# Altium schematic sheet 3_BackBone.SchDoc
size A3; DocumentNumber: 4; SheetNumber: 4; SheetTotal: 6
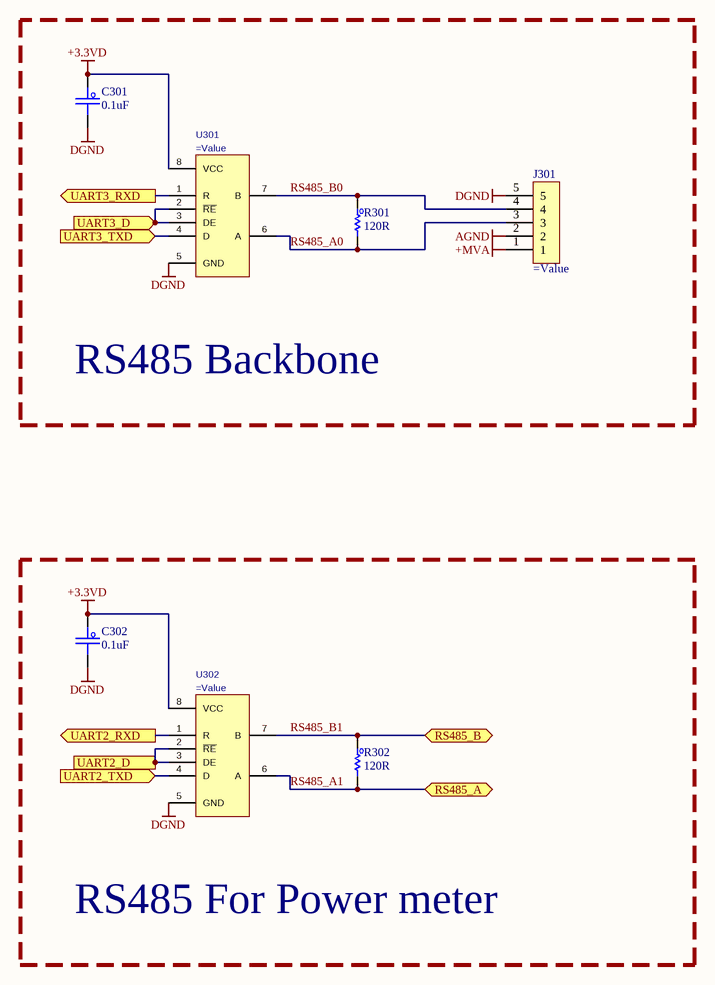
[diagram p0: 3_BackBone.SchDoc]

## Parts
C301  0.1uF  [C_0603]  (no BOM)
C302  0.1uF  [C_0603]
J301  (no value)  [CON_9155005541006]  (no BOM)
R301  120R  [R_0603]  (no BOM)
R302  120R  [R_0603]
U301  (no value)  [D0008A_L]  (no BOM)
U302  (no value)  [D0008A_L]

## Blocks framed on the sheet
RS485 Backbone: C301 J301 R301 U301
RS485 For Power meter: C302 R302 U302

## Ports
RS485_A (bidir), RS485_B (bidir), UART2_D (in), UART2_RXD (out), UART2_TXD (in), UART3_D (in), UART3_RXD (out), UART3_TXD (in)

## Nets
+3.3VD: C301.1 C302.1 U301.8(VCC) U302.8(VCC)
+MVA: J301.1
AGND: J301.2
DGND: C301.2 C302.2 J301.5 U301.5(GND) U302.5(GND)
RS485_A0: J301.3 R301.2 U301.6(A)
RS485_A1: R302.2 U302.6(A) ; port RS485_A
RS485_B0: J301.4 R301.1 U301.7(B)
RS485_B1: R302.1 U302.7(B) ; port RS485_B
UART2_D: U302.2(~{RE}) U302.3(DE) ; port UART2_D
UART2_RXD: U302.1(R) ; port UART2_RXD
UART2_TXD: U302.4(D) ; port UART2_TXD
UART3_D: U301.2(~{RE}) U301.3(DE) ; port UART3_D
UART3_RXD: U301.1(R) ; port UART3_RXD
UART3_TXD: U301.4(D) ; port UART3_TXD

## Notes on the sheet
- Title :
- Revision :
- ผู้จัดทำ:
- Size:
- A3
- Time:
- ผู้เขียน:
- บริษัท ยูนิเวอร์แซล ยูทีลิตี้ส์ จำกัด (มหาชน) เลขที่ 1 อาคาร อีสท์วอเตอร์ ชั้น 18 ซอยวิภาวดีรังสิต 5 แขวงจอมพล เขตจตุจักร กรุงเทพฯ 10900
  Tel : +662-272-1688
  Fax :+662-2721690-1
- -
- Sheet:
- of
- ผู้อำนวยการ
- ผู้ตรวจสอบ:
- Number:
- กรรมการผู้จัดการ:
- File:

## Library data of the parts
C301 C302 = C_Capacitor: CAP CER 0.1UF 50V X7R 0603; Manufacturer: KEMET; PartNumber: C0603C104K5RACTU; PackageReference: 0603; PartID: 399-5089-1-ND; Value2: 50V; Value: 0.1uF; Value3: *
J301 = CON_5P_9155005541006: CONN SPRING BATTERY 5POS R/A SMD; PartNumber: 009155005541006; Manufacturer: AVX; Value: 009155005541006; PartID: 478-5453-1-ND; PackageReference: *; Value2: *; Value3: *
R301 R302 = R_Resister: RES SMD 120 OHM 1% 1/3W 0603; Manufacturer: Vishay Dale; PartNumber: CRCW0603120RFKEAHP; Value2: 0.333W; Value: 120R; PackageReference: 0603; PartID: 541-120SCT-ND; Value3: *
U301 U302 = IC_TRAN_THVD1505DR: IC TRANSCEIVER HALF 1/1 8SOIC; Manufacturer: Texas Instruments; PartNumber: SN65HVD11DR; Value: SN65HVD11DR; Value3: SN65HVD1780QDRQ1; PackageReference: 8SOIC; PartID: 0086-0766-1